# EAGLE design pecoskiSmartWatch-BASIC-BOTTOM (EAGLE 9.6.2)
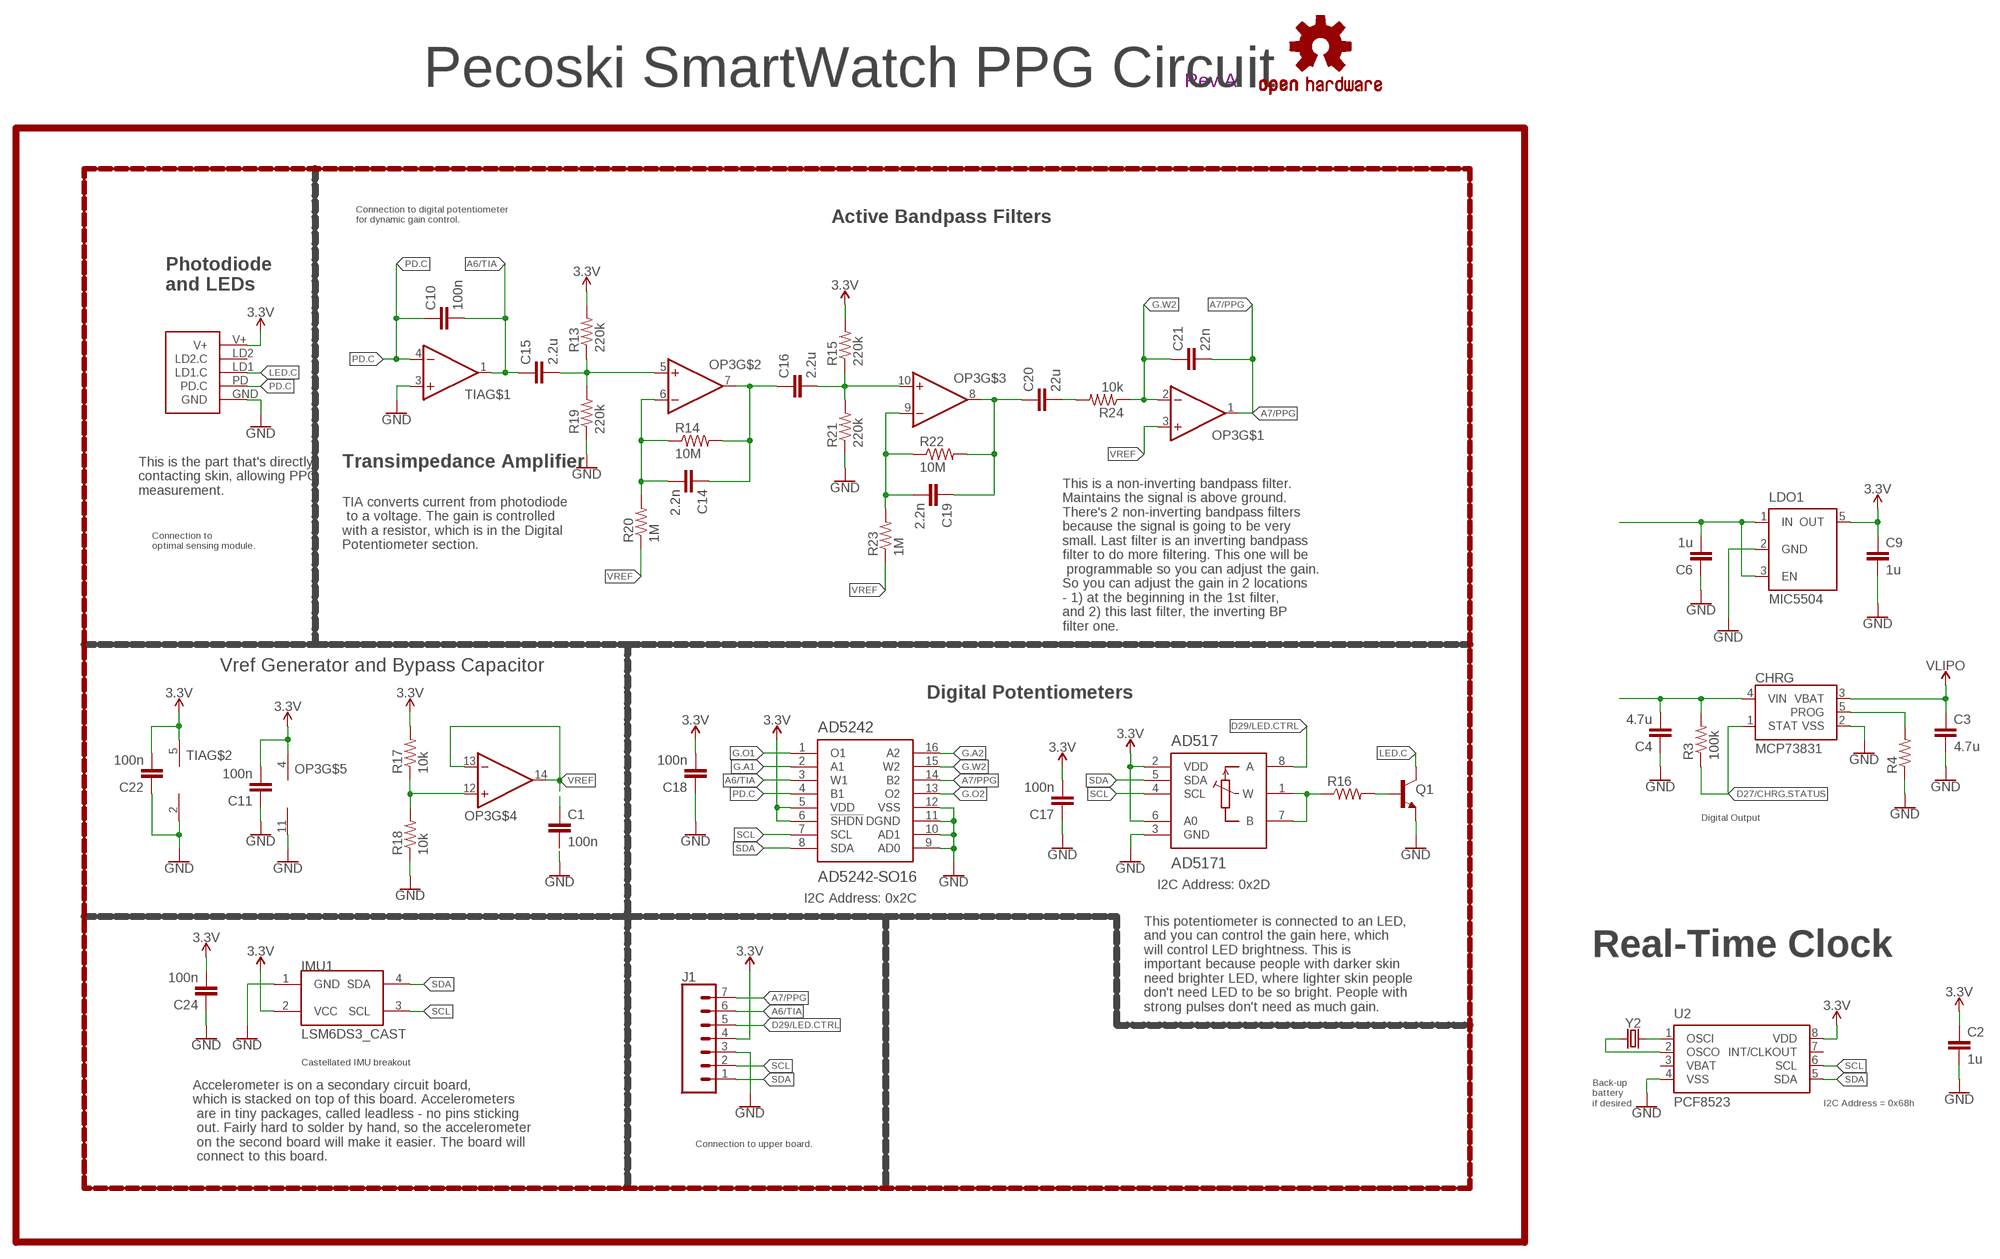
[diagram p0: schematic, sheet 1]

## Parts
AD517  AD5171  [SOT-23-8]
AD5242  AD5242-SO16  [SO16]
C1  100n  CAPACITOR0603  [C0603]
C2  1u  CAPACITOR0603  [C0603]
C3  4.7u  CAPACITOR0603  [C0603]
C4  4.7u  CAPACITOR0603  [C0603]
C6  1u  CAPACITOR0603  [C0603]
C9  1u  CAPACITOR0603  [C0603]
C10  100n  CAPACITOR0603  [C0603]
C11  100n  CAPACITOR0603  [C0603]
C14  2.2n  CAPACITOR0603  [C0603]
C15  2.2u  CAPACITOR0603  [C0603]
C16  2.2u  CAPACITOR0603  [C0603]
C17  100n  CAPACITOR0603  [C0603]
C18  100n  CAPACITOR0603  [C0603]
C19  2.2n  CAPACITOR0603  [C0603]
C20  22u  CAPACITOR0603  [C0603]
C21  22n  CAPACITOR0603  [C0603]
C22  100n  CAPACITOR0603  [C0603]
C24  100n  CAPACITOR0603  [C0603]
CHRG  MCP73831  [SOT23-5]
IMU1  LSM6DS3_CAST  [LSM6DS3_CAST]
J1  CONN_07-1.27MM  [1X07_1.27MM]
LDO1  MIC5504  [SOT23-5]
LOGO1  REVISION.A  [REV.A]
LOGO2  OSHW-LOGOS  [OSHW-LOGO-S]
OP3  OP-QUAD-SO14  [SO14]
Q1  NPN-GENERIC  [SOT23-3]
R3  100k  RESISTOR0603  [R0603]
R4  RESISTOR0603  [R0603]
R13  220k  RESISTOR0603  [R0603]
R14  10M  RESISTOR0603  [R0603]
R15  220k  RESISTOR0603  [R0603]
R16  RESISTOR0603  [R0603]
R17  10k  RESISTOR0402  [R0402]
R18  10k  RESISTOR0402  [R0402]
R19  220k  RESISTOR0603  [R0603]
R20  1M  RESISTOR0603  [R0603]
R21  220k  RESISTOR0603  [R0603]
R22  10M  RESISTOR0603  [R0603]
R23  1M  RESISTOR0603  [R0603]
R24  10k  RESISTOR0603  [R0603]
TIA  OP-SINGLEOT  [SOT23-5]
U2  PCF8523  [SO8]
U$3  PPG.MODULE.2  [PPG.MODULE.2]
Y2  32.7680kHz  CRYSTALECS-.327-12.5-12-C-TR  [2-SMD.NOLEAD.2.0MMTO1.2MM]

## Nets
3.3V: AD517.2(VDD) AD517.6(A0) AD5242.5(VDD) AD5242.6(!SHDN) C2.1 C9.1 C11.2 C17.2 C18.2 C22.2 C24.2 IMU1.2(VCC) J1.4 LDO1.5(OUT) OP3.4(V+) R13.2 R15.2 R17.2 TIA.5(V+) U2.8(VDD) U$3.V+
A6/TIA: AD5242.3(W1) C10.2 C15.1 J1.6 TIA.1(OUT)
A7/PPG: AD5242.14(B2) C21.2 J1.7 OP3.1(OUT)
D27/CHRG.STATUS: CHRG.1(STAT) R3.1
D29/LED.CTRL: AD517.8(A) J1.5
G.A1: AD5242.2(A1)
G.A2: AD5242.16(A2)
G.O1: AD5242.1(O1)
G.O2: AD5242.13(O2)
G.W2: AD5242.15(W2) C21.1 OP3.2(-IN) R24.1
GND: AD517.3(GND) AD5242.9(AD0) AD5242.10(AD1) AD5242.11(DGND) AD5242.12(VSS) C1.2 C2.2 C3.2 C4.1 C6.1 C9.2 C11.1 C17.1 C18.1 C22.1 C24.1 CHRG.2(VSS) IMU1.1(GND) J1.3 LDO1.2(GND) OP3.11(V-) Q1.2(E) R4.1 R18.1 R19.1 R21.1 TIA.2(V-) TIA.3(+IN) U2.4(VSS) U$3.GND
LED.C: Q1.3(C) U$3.LD1(LD1.C)
N$1: U2.2(OSCO) Y2.P$1
N$2: U2.1(OSCI) Y2.P$2
N$3: CHRG.5(PROG) R4.2
N$8: Q1.1(B) R16.2
N$9: AD517.1(W) AD517.7(B) R16.1
N$10: OP3.12(+IN) R17.1 R18.2
N$13: C15.2 OP3.5(+IN) R13.1 R19.2
N$15: C14.2 OP3.6(-IN) R14.1 R20.2
N$16: C14.1 C16.1 OP3.7(OUT) R14.2
N$17: C16.2 OP3.10(+IN) R15.1 R21.2
N$18: C19.2 OP3.9(-IN) R22.1 R23.2
N$19: C19.1 C20.1 OP3.8(OUT) R22.2
N$20: C20.2 R24.2
PD.C: AD5242.4(B1) C10.1 TIA.4(-IN) U$3.PD(PD.C)
SCL: AD517.4(SCL) AD5242.7(SCL) IMU1.3(SCL) J1.2 U2.6(SCL)
SDA: AD517.5(SDA) AD5242.8(SDA) IMU1.4(SDA) J1.1 U2.5(SDA)
VIN1: C4.2 C6.2 CHRG.4(VIN) LDO1.1(IN) LDO1.3(EN) R3.2
VLIPO: C3.1 CHRG.3(VBAT)
VREF: C1.1 OP3.3(+IN) OP3.13(-IN) OP3.14(OUT) R20.1 R23.1
Unconnected: U2.7(INT/CLKOUT) U$3.LD2(LD2.C)

## Notes on the sheet
- Pecoski SmartWatch PPG Circuit
- Connection to digital potentiometer 
  for dynamic gain control.
- Active Bandpass Filters
- Photodiode
  and LEDs
- Transimpedance Amplifier
- This is the part that's directly 
  contacting skin, allowing PPG 
  measurement.
- Connection to 
  optimal sensing module.
- TIA converts current from photodiode
   to a voltage. The gain is controlled 
  with a resistor, which is in the Digital 
  Potentiometer section.
- This is a non-inverting bandpass filter. 
  Maintains the signal is above ground. 
  There's 2 non-inverting bandpass filters 
  because the signal is going to be very 
  small. Last filter is an inverting bandpass 
  filter to do more filtering. This one will be
   programmable so you can adjust the gain. 
  So you can adjust the gain in 2 locations 
  - 1) at the beginning in the 1st filter, 
  and 2) this last filter, the inverting BP 
  filter one.
- Vref Generator and Bypass Capacitor
- Digital Potentiometers
- Digital Output
- I2C Address: 0x2D
- I2C Address: 0x2C
- Real-Time Clock
- This potentiometer is connected to an LED, 
  and you can control the gain here, which 
  will control LED brightness. This is 
  important because people with darker skin 
  need brighter LED, where lighter skin people 
  don't need LED to be so bright. People with 
  strong pulses don't need as much gain.
- Castellated IMU breakout
- Back-up
  battery
  if desired
- I2C Address = 0x68h
- Connection to upper board.
- Accelerometer is on a secondary circuit board, 
  which is stacked on top of this board. Accelerometers
   are in tiny packages, called leadless - no pins sticking
   out. Fairly hard to solder by hand, so the accelerometer
   on the second board will make it easier. The board will
   connect to this board.

## Power pins joined to a net without a drawn wire
VBAT: U2.3(VBAT)

## Library data of the parts
AD517 = LinnesLab-DigitalIC:AD5171
AD5242 = LinnesLab-DigitalIC:AD5242
C1-C4 C6 C9-C11 C14-C22 C24 = LinnesLab-Passives:CAPACITOR
CHRG = LinnesLab-Power:MCP73831: MCP73831T Li-Ion, Li-Pol Controller Miniature single cell, fully integrated Li-Ion, Li-polymer charge management controller Datasheet <http://ww1.microchip.com/downloads/en/DeviceDoc/20001984g.pdf> SparkFun Products: SparkFun ESP32 Thing <https://www.sparkfun.com/products/13907> SparkFun 9DoF Razor IMU M0 <https://www.sparkfun.com/products/14001>; PROD_ID: IC-09995
IMU1 = LinnesLab-Sensors:LSM6DS3_CAST
J1 = LinnesLab-Connectors:CONN_07: Multi connection point. Often used as Generic Header-pin footprint for 0.1 inch spaced/style header connections On any of the 0.1 inch spaced packages, you can populate with these: Break Away Headers - Straight <https://www.sparkfun.com/products/116> (PRT-00116) Break Away Male Headers - Right Angle <https://www.sparkfun.com/products/553> (PRT-00553) Female Headers <https://www.sparkfun.com/products/115> (PRT-00115) Break Away Headers - Machine Pin <https://www.sparkfun.com/products/117> (PRT-00117) Break Away Female Headers - Swiss Machine Pin <https://www.sparkfun.com/products/743> (PRT-00743) For SCREWTERMINALS and SPRING TERMINALS visit here: Screw Terimnals on SparkFun.com <https://www.sparkfun.com/search/results?term=Screw+Terminals> (5mm/3.5mm/2.54mm spacing) This device is also useful as a general connection point to wire up your design to another part of your project. Our various solder wires solder well into these plated through hole pads. Hook-Up Wire - Assortment (Stranded, 22 AWG) <https://www.sparkfun.com/products/11375> (PRT-11375) Hook-Up Wire - Assortment (Solid Core, 22 AWG) <https://www.sparkfun.com/products/11367> (PRT-11367) View the entire wire category on our website here <https://www.sparkfun.com/categories/141> Special notes: Molex polarized connector foot print use with SKU : PRT-08231 with associated crimp pins and housings. 1MM SMD Version SKU: PRT-10208 NOTES ON THE VARIANTS LOCK and LOCK_LONGPADS... This footprint was designed to help hold the alignment of a through-hole component (i.e. 6-pin header) while soldering it into place. You may notice that each hole has been shifted either up or down by 0.005 of an inch from it's more standard position (which is a perfectly straight line). This slight alteration caused the pins (the squares in the middle) to touch the edges of the holes. Because they are alternating, it causes a "brace" to hold the component in place. 0.005 has proven to be the perfect amount of "off-center" position when using our standard breakaway headers. Although looks a little odd when you look at the bare footprint, once you have a header in there, the alteration is very hard to notice. Also,if you push a header all the way into place, it is covered up entirely on the bottom side.
LDO1 = LinnesLab-Power:MIC5504: MIC5504 Voltage Regulator Output Voltages: 1.0V to 3.3V Input Voltages: 2.5V to 5.5V Link to Datasheet http://ww1.microchip.com/downloads/en/DeviceDoc/MIC550X.pdf
LOGO1 = LinnesLab-Logos:REVISION.A
LOGO2 = LinnesLab-Logos:OSHW-LOGO: Open-Source Hardware (OSHW) Logo This logo indicates the piece of hardware it is found on incorporates a OSHW license and/or adheres to the definition of open source hardware found here: http://freedomdefined.org/OSHW
OP3 = LinnesLab-AnalogIC:OP-QUAD: General symbol and footprints for Quad Op Amps. Use with any standard general purpose op amp.
Q1 = LinnesLab-DiscreteSemi:NPN
R3 R4 R13-R24 = LinnesLab-Passives:RESISTOR
TIA = LinnesLab-AnalogIC:OP-SINGLE: Single Op Amp 2.7V to 6.0V Single Supply CMOS Source: http://ww1.microchip.com/downloads/en/DeviceDoc/21314g.pdf
U2 = LinnesLab-Clocks:PCF8523; DIGIKEY: 568-5306-1-ND; I2C_ADDRESS: 0x68h; MFN: PCF8523T/1,118; MFN_MANUFACTURER: NXP USA Inc.
U$3 = LinnesLab-Connectors:PPG.MODULE.2: Digi-Key Part Number: S9014E-50-ND Manufacturer Part Number: GRPB501VWVN-RC Description: 1mm insulation height 0.05in pitch 50 positions
Y2 = LinnesLab-Clocks:CRYSTAL; DIGIKEY: XC2288CT-ND; FREQ: 32.7680KHZ; LOAD_CAP: 12.5pF

## Board
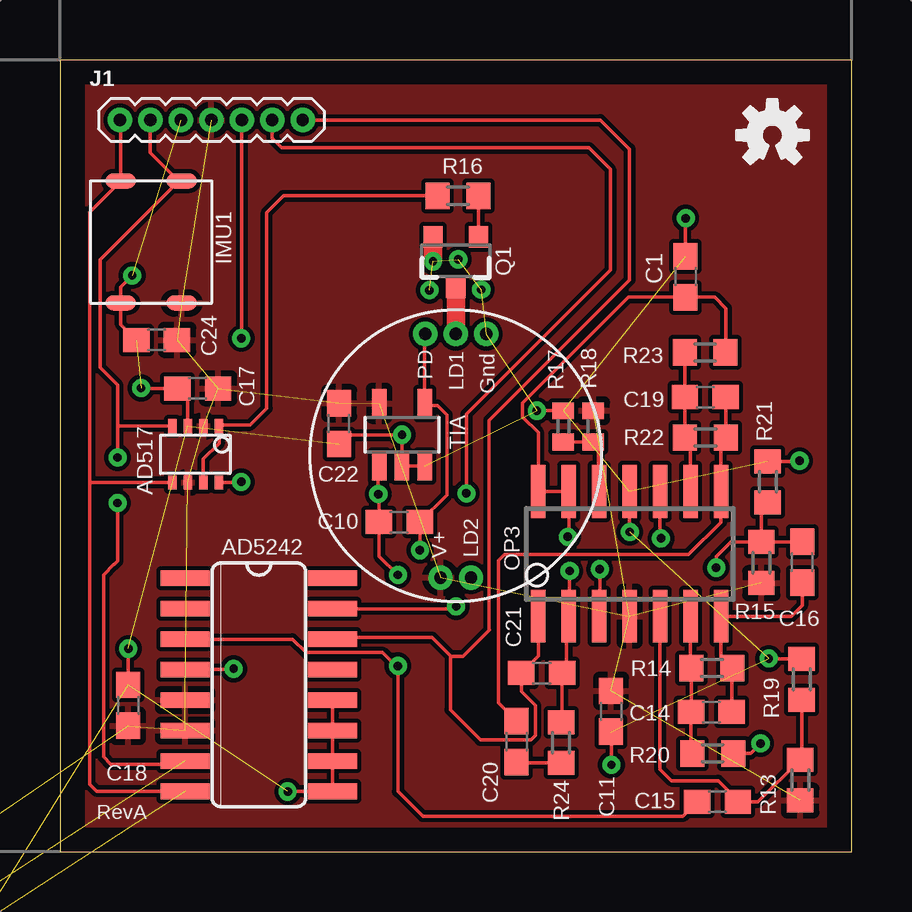
[diagram p1: board, top side]
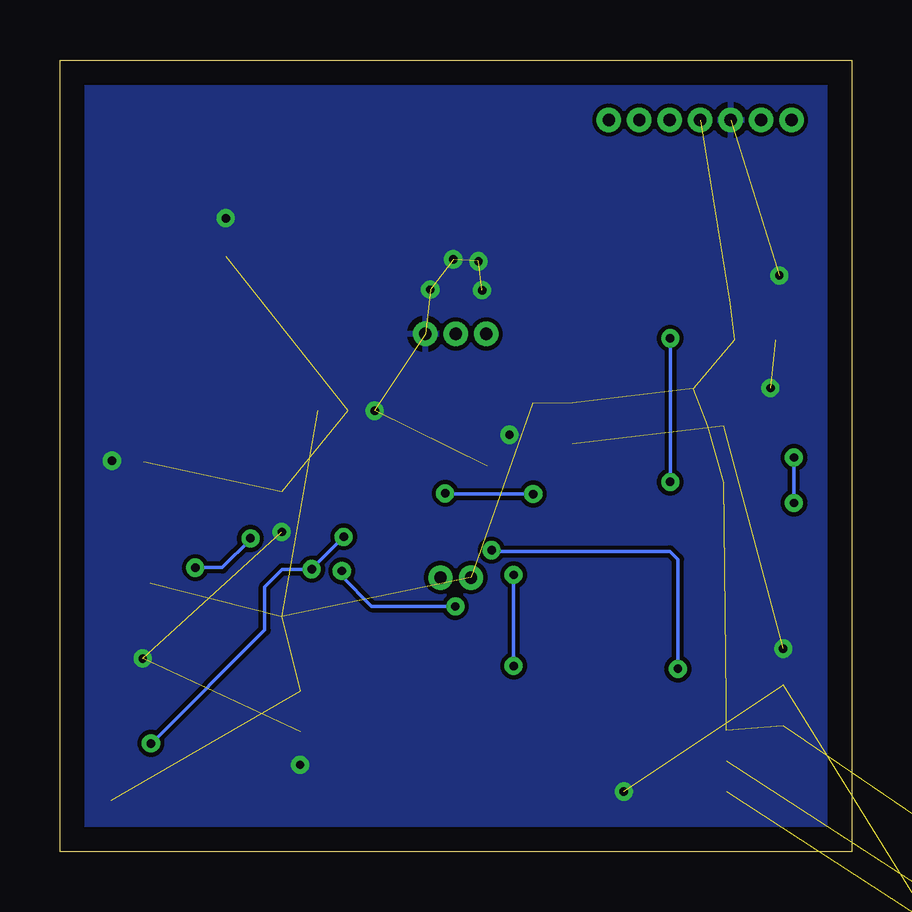
[diagram p2: board, bottom side, seen from below]

Size 33 x 33 mm. Coordinates in mm from the lower left corner, seen from the top.
Outline: 0,0 33,0 33,33 0,33 0,0
Copper layers (1*16): Top 0.035mm / dielectric 1.5mm / Bottom 0.035mm
Design rules "default": minimum track width 6mil, minimum drill 0.35mm, track to track 6mil, track to pad 6mil, pad to pad 6mil, via to via 6mil, smd to smd 6mil, copper to edge 40mil, drill to drill 6mil, minimum pad ring 10mil, minimum via ring 8mil, stop-mask expansion 4mil, vias tented up to drill 0mil, thermal gap 10mil

### Footprints (pad centres in the part's own frame; a part is rotated, then mirrored left to right if it is on the bottom)
SOT-23-8 = smd 0.35 x 0.6: 1 -0.991,-1.176; 2 -0.341,-1.176; 3 0.309,-1.176; 4 0.959,-1.176; 5 0.959,1.176; 6 0.309,1.176; 7 -0.341,1.176; 8 -0.991,1.176
SO16 = smd 0.66 x 2.032: 1 -4.445,-3.073; 2 -3.175,-3.073; 3 -1.905,-3.073; 4 -0.635,-3.073; 5 0.635,-3.073; 6 1.905,-3.073; 7 3.175,-3.073; 8 4.445,-3.073; 9 4.445,3.073; 10 3.175,3.073; 11 1.905,3.073; 12 0.635,3.073; 13 -0.635,3.073; 14 -1.905,3.073; 15 -3.175,3.073; 16 -4.445,3.073
C0603 = smd 1.1 x 1: 1 -0.85,0; 2 0.85,0
SOT23-5 = smd 0.55 x 1.2: 1 -0.95,-1.3; 2 0,-1.3; 3 0.95,-1.3; 4 0.95,1.3; 5 -0.95,1.3
LSM6DS3_CAST = smd 0.635 x 1.27: 1 -2.54,1.27; 2 -2.54,-1.27; 3 2.54,-1.27; 4 2.54,1.27
1X07_1.27MM = drill 0.508 pad 1: 1 0,0; 2 1.27,0; 3 2.54,0; 4 3.81,0; 5 5.08,0; 6 6.35,0; 7 7.62,0
SO14 = smd 0.6 x 2.2: 1 -3.81,-2.6; 2 -2.54,-2.6; 3 -1.27,-2.6; 4 0,-2.6; 5 1.27,-2.6; 6 2.54,-2.6; 7 3.81,-2.6; 8 3.81,2.6; 9 2.54,2.6; 10 1.27,2.6; 11 0,2.6; 12 -1.27,2.6; 13 -2.54,2.6; 14 -3.81,2.6
SOT23-3 = smd 0.8 x 0.9: 1 -0.95,-1; 2 0.95,-1; 3 0,1.1
R0603 = smd 1 x 1.1: 1 -0.85,0; 2 0.85,0
R0402 = smd 0.7 x 0.9: 1 -0.65,0; 2 0.65,0
SOT23-5' = smd 0.6 x 1.2: 1 -0.95,-1.306; 2 0,-1.306; 3 0.95,-1.306; 4 0.95,1.306; 5 -0.95,1.306
SO8 = smd 1.3 x 0.6: 1 -2.65,1.905; 2 -2.65,0.635; 3 -2.65,-0.635; 4 -2.65,-1.905; 5 2.65,-1.905; 6 2.65,-0.635; 7 2.65,0.635; 8 2.65,1.905
PPG.MODULE.2 = drill 0.508 pad 0.94: GND 1.27,5.08; LD1 0,5.08; LD2 0.635,-5.08; PD -1.27,5.08; V+ -0.635,-5.08
2-SMD.NOLEAD.2.0MMTO1.2MM = smd 0.7 x 1.3: P$1 -0.8,0; P$2 0.8,0

### Placement (x,y rotation side)
AD517  5.64,16.56 180 top
AD5242  8.29,6.95 270 top
C1  26.08,23.96 90 top
C2  -9.89,-12.24 0 top  (outside the outline)
C3  -16.17,-21.1 0 top  (outside the outline)
C4  -13.08,-21.1 0 top  (outside the outline)
C6  -10,-21.1 0 top  (outside the outline)
C9  -16.17,-25.17 0 top  (outside the outline)
C10  14.14,13.73 180 top
C11  22.98,5.85 90 top
C14  27.16,5.82 180 top
C15  27.41,2.07 0 top
C16  30.95,12.06 90 top
C17  5.74,19.31 0 top
C18  2.84,6.1 270 top
C19  26.9,18.95 180 top
C20  19.03,4.58 270 top
C21  20.08,7.44 180 top
C22  11.64,17.84 90 top
C24  4.03,21.33 0 top
CHRG  -14.86,-17.05 0 top  (outside the outline)
IMU1  3.8,25.41 90 top
J1  2.5,30.5 0 top
LDO1  -11.86,-25.51 0 top  (outside the outline)
LOGO1  1.53,1.35 0 top
LOGO2  29.7,29.86 0 top
OP3  23.75,12.41 0 top
Q1  16.5,24.63 180 top
R3  -10.32,-16.32 0 top  (outside the outline)
R4  -16.17,-29.25 0 top  (outside the outline)
R13  30.86,2.98 270 top
R14  27.18,7.65 0 top
R15  29.24,12.05 270 top
R16  16.59,27.33 0 top
R17  22.23,17.73 90 top
R18  20.98,17.73 270 top
R19  30.92,7.17 270 top
R20  27.21,4.09 180 top
R21  29.5,15.41 270 top
R22  26.91,17.26 0 top
R23  26.89,20.81 180 top
R24  20.89,4.54 270 top
TIA  [SOT23-5']  14.26,17.38 0 top
U2  -14.27,-6.51 0 top  (outside the outline)
U$3  16.5,16.5 0 top
Y2  -15.33,-12.45 0 top  (outside the outline)

### Tracks (layer width: path | path; a pad name or v marks a point on that pad's centre or on a via)
3.3V  (20 unrouted)
  pour Top (isolate 0.178): 0.75,32.37 32.04,32.37 32.04,0.83 0.7,0.83 0.7,32.35
A6/TIA  (via drill 0.35)
  Top 0.152: TIA.1 13.27,16.03 v13.27,14.9 13.29,14.88 C10.2 13.31,13.71 13.31,12.31 v14.09,11.53 | v14.09,7.74 14.09,7.64 | 14.09,7.64 14.09,2.51 15.12,1.47 25.96,1.47 C15.1 | AD5242.3 9.7,8.85 10.26,8.29 13.44,8.29 14.09,7.64 | J1.6 8.85,29.73 9.25,29.33 22.05,29.33 22.94,28.44 22.94,24.23 16.94,18.24 v16.94,14.93
  Bottom 0.152: v14.09,11.53 v14.09,7.74 | v16.94,14.93 16.92,14.91 v13.27,14.91 v13.27,14.9
A7/PPG
  Top 0.152: OP3.1 19.94,8.15 C21.2 19.23,6.68 19.82,6.09 19.82,4.84 19.63,4.65 17.53,4.65 16.27,5.91 16.27,8.14 | AD5242.14 11.43,8.92 15.52,8.92 16.27,8.16 16.27,8.14 | J1.7 22.53,30.5 23.74,29.29 23.74,23.83 17.89,17.98 17.89,9.27 17.9,9.25 16.79,8.14 16.27,8.14
D27/CHRG.STATUS  (1 unrouted)
D29/LED.CTRL  (via drill 0.35)
  Top 0.152: J1.5 7.58,21.41 v7.56,21.39 | v7.56,15.41 7.53,15.38 AD517.8
  Bottom 0.152: v7.56,21.39 v7.56,15.41
G.W2  (via drill 0.35)
  Top 0.152: R24.1 20.93,5.43 C21.1 21.11,7.62 21.11,9.71 OP3.2 21.25,9.85 v21.25,11.7 | v16.51,10.22 16.42,10.12 AD5242.15
  Bottom 0.152: v16.51,10.22 20.01,10.22 21.25,11.46 v21.25,11.7
GND  (via drill 0.35)  (25 unrouted)
  Top 0.152: R18.1 v19.88,18.38 | v19.88,18.38 | OP3.11 v23.75,13.33 v23.75,13.32 | R21.1 30.8,16.26 v30.83,16.29 | R19.1 29.57,8.03 v29.55,8.05 | C11.1 v22.99,3.62 | C18.1 v2.84,8.45 v2.85,8.46 | v14.26,17.37 TIA.2 TIA.3 | v14.26,17.37 v14.26,17.38 | C22.1 12.03,17.37 v14.26,17.37 | AD5242.12 AD5242.11 AD5242.10 AD5242.9 v9.5,2.5 | C24.1 2.53,21.97 IMU1.1 2.53,23.54 v3.01,24.02 | AD517.3 5.33,18.87 C17.1 3.39,19.31 v3.38,19.32 | C1.2 v26.08,26.4 v26.09,26.4
  Top 0.762: Q1.2 v15.55,24.6 | v15.55,24.6
  other vias: 15.4,23.4 17.56,23.43 16.6,24.69
  pour Bottom (isolate 0.178): 32.42,32.42 32.47,32.47 32.47,0.9 32.32,0.75 0.7,0.75 0.6,0.85 0.6,32.34
LED.C
  Top 0.762: Q1.3 U$3.LD1
N$1  (1 unrouted)
N$2  (1 unrouted)
N$3  (1 unrouted)
N$8
  Top 0.152: R16.2 17.45,27.32 Q1.1
N$9
  Top 0.152: R16.1 9.31,27.34 8.62,26.64 8.62,18.48 7.93,17.79 6.68,17.79 AD517.1 6.63,17.01 5.98,16.36 AD517.7
N$10
  Top 0.152: R18.2 R17.1 | R17.1 | R17.1 22.45,16.86 22.45,15.04 OP3.12
N$13
  Top 0.152: R19.2 30.92,3.89 R13.1 29.1,2.07 C15.2 28.26,2.14 27.44,2.96 25.5,2.96 25.02,3.44 OP3.5
N$15
  Top 0.152: OP3.6 26.28,7.7 R14.1 26.33,5.84 C14.2 26.31,4.15 R20.2
N$16
  Top 0.152: C14.1 28.01,7.63 R14.2 27.56,8.12 OP3.7 30.49,9.81 30.95,10.26 C16.1
N$17  (via drill 0.35)
  Top 0.152: C16.2 29.25,12.91 R15.1 | R21.2 29.24,14.3 R15.1 | v25.06,13.05 25.02,13.09 OP3.10 | R15.1 27.97,12.9 27.36,12.29 v27.36,11.84
  Bottom 0.152: v25.06,13.05 25.06,13.02 26.24,11.84 v27.36,11.84
N$18
  Top 0.152: OP3.9 26.29,17.03 R22.1 C19.2 26.05,20.8 R23.2
N$19
  Top 0.152: C19.1 R22.2 27.56,17.06 OP3.8 27.56,13.73 26.21,12.38 18.52,12.38 18.27,12.12 18.27,6.19 C20.1 | C20.1
N$20
  Top 0.152: R24.2 19.07,3.69 C20.2
PD.C  (via drill 0.35)
  Top 0.152: U$3.PD 15.21,21.56 TIA.4 15.21,18.6 15.74,18.6 16.13,18.2 16.13,14.87 C10.1 15.01,13.71 v15.01,12.56 | AD5242.4 7.21,7.58 v7.24,7.62
  Bottom 0.152: v7.24,7.62 7.24,12.18 7.57,12.51 14.96,12.51 v15.01,12.56
SCL  (via drill 0.35)  (1 unrouted)
  Top 0.152: AD5242.7 5.09,3.64 2.11,3.64 1.82,3.94 1.82,11.54 2.25,11.97 2.26,11.97 2.4,12.11 v2.4,14.53 | v2.4,16.43 2.4,17.67 | 2.4,17.67 2.4,19.44 1.67,20.17 1.67,24.67 4.96,27.95 | AD517.4 2.47,17.73 2.4,17.67 | 4.96,27.95 IMU1.3 | J1.2 3.77,29.14 4.96,27.95
  Bottom 0.152: v2.4,14.53 v2.4,16.43
SDA  (1 unrouted)
  Top 0.152: J1.1 2.53,30.47 IMU1.4 1.23,26.65 1.23,15.36 | AD5242.8 1.53,2.51 1.23,2.81 1.23,15.35 1.23,15.36 | AD517.5 1.26,15.38 1.23,15.36
VIN1  (5 unrouted)
VLIPO  (1 unrouted)
VREF  (via drill 0.35)
  Top 0.152: R23.1 27.76,20.83 27.76,22.64 27.29,23.11 C1.1 23.69,23.11 19.27,18.7 19.27,18.12 19.94,17.46 OP3.14 OP3.13 21.21,13.16 v21.17,13.12 | R20.1 28.79,4.09 v29.21,4.51 | v22.5,11.77 22.5,9.84 OP3.3
  Bottom 0.152: v29.21,4.51 29.16,4.56 29.14,4.56 24.46,9.24 24.46,11.04 23.73,11.77 v22.5,11.77 22.5,11.79 v21.17,13.12